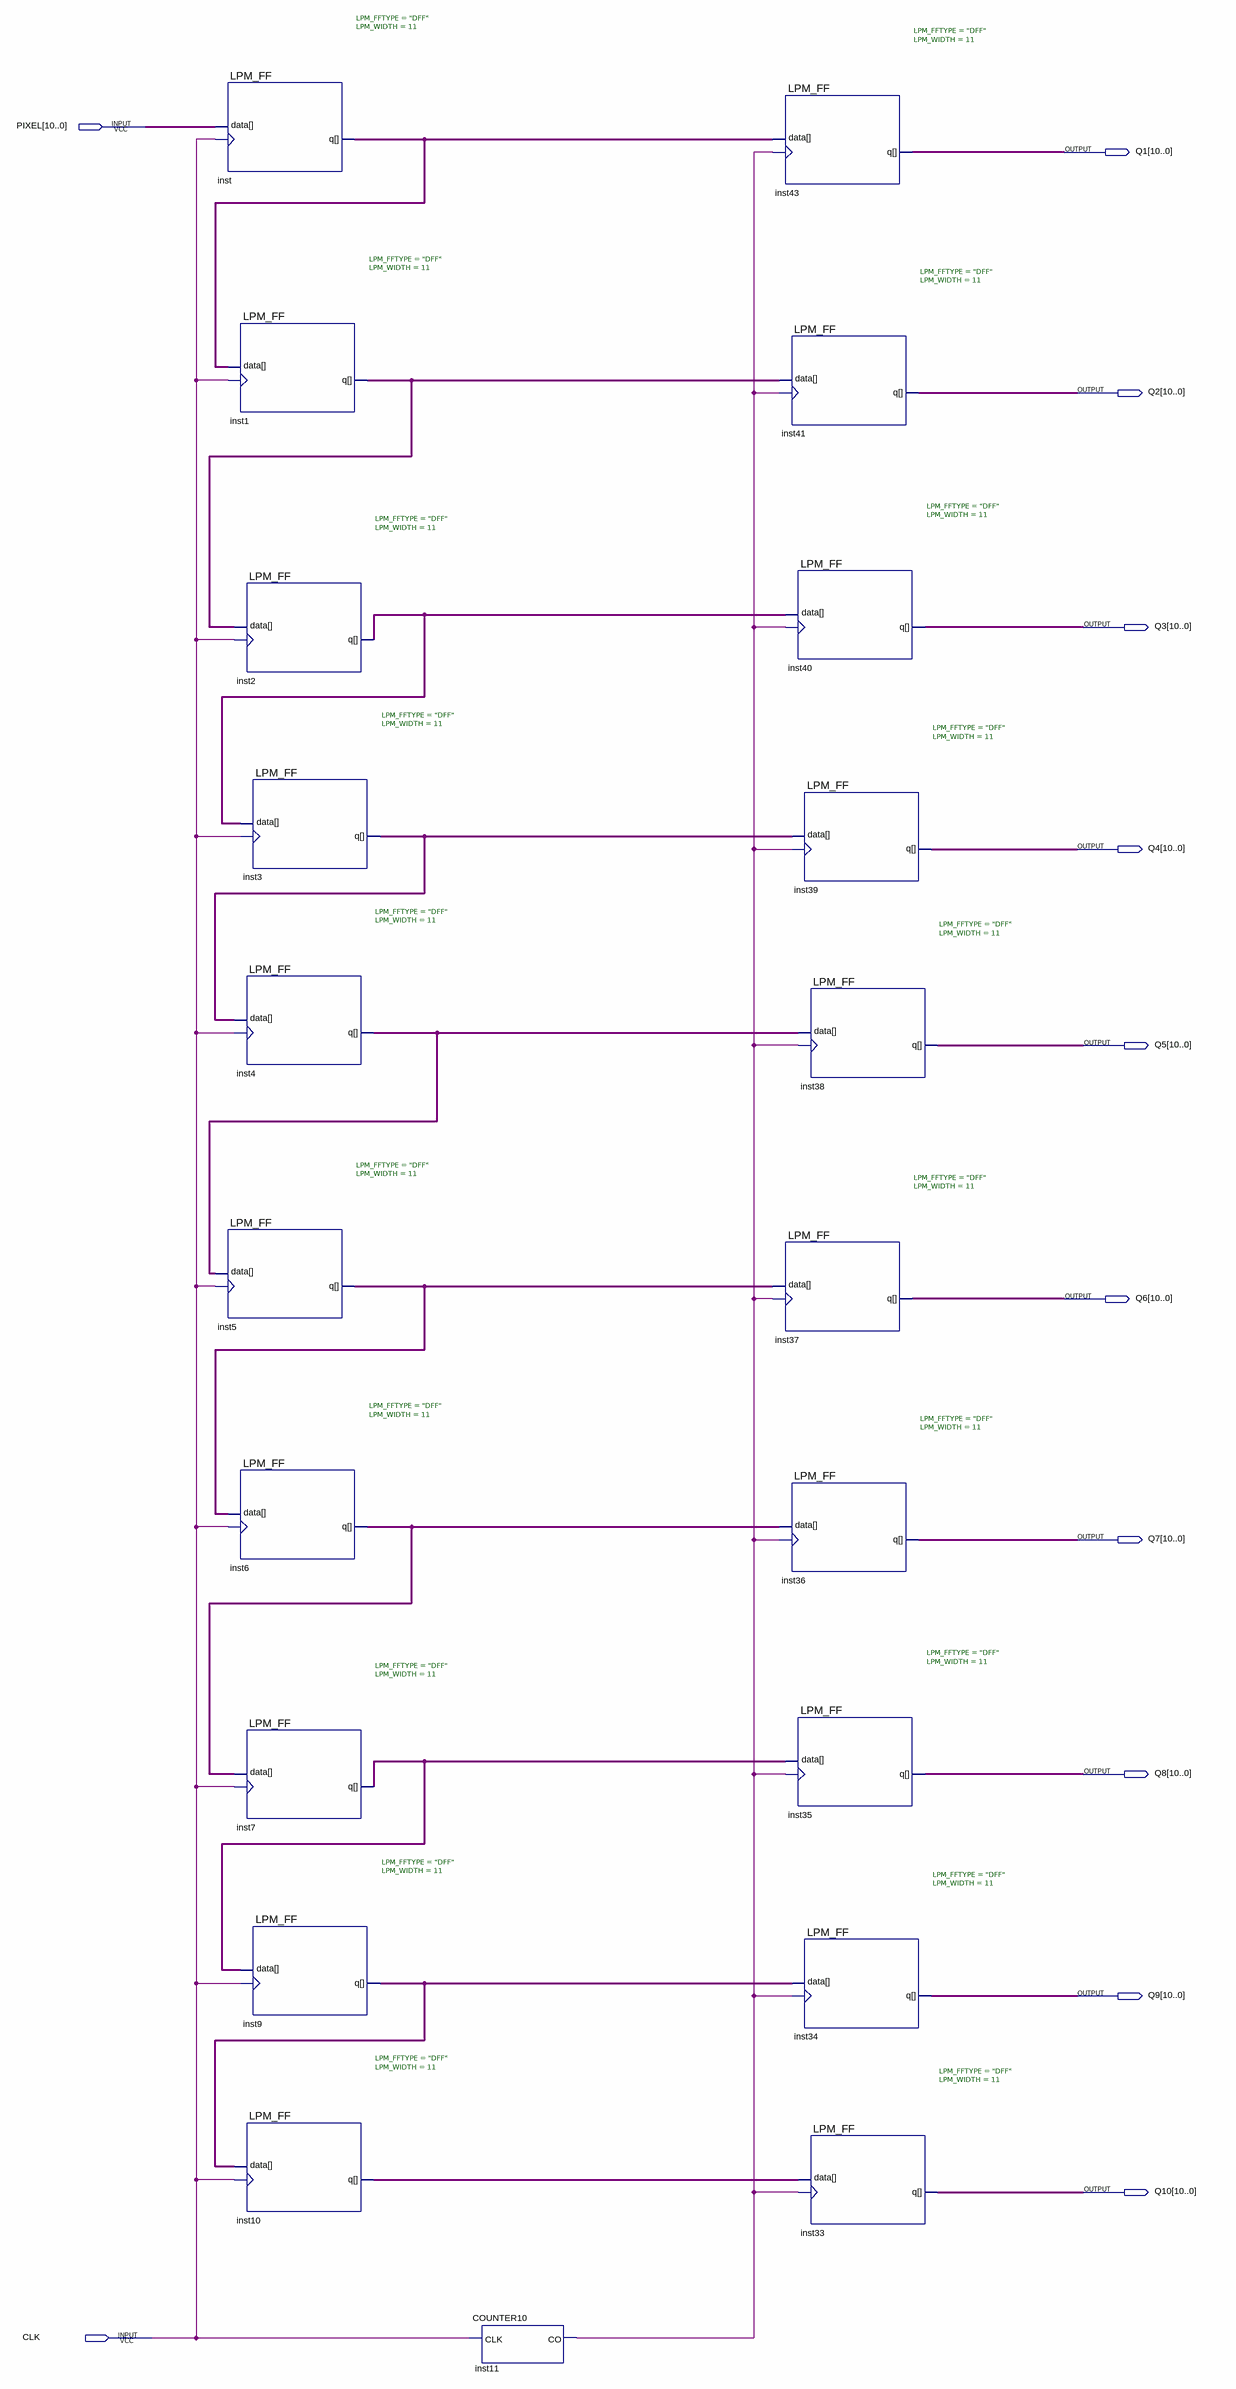
[diagram p0: schematic sheet]
// Quartus schematic SIPO10.bdf as structural Verilog: 21 symbols, 12 pins
module SIPO10 (
  input  [10:0] PIXEL,
  input  CLK,
  output [10:0] Q1,
  output [10:0] Q2,
  output [10:0] Q3,
  output [10:0] Q4,
  output [10:0] Q5,
  output [10:0] Q6,
  output [10:0] Q7,
  output [10:0] Q8,
  output [10:0] Q9,
  output [10:0] Q10
);

  wire inst11_co;
  wire [10:0] inst1_q, inst2_q, inst3_q, inst4_q, inst5_q, inst6_q, inst7_q, inst9_q, inst10_q, inst_q;

  LPM_FF #(.LPM_FFTYPE("DFF"), .LPM_WIDTH(11)) inst (.clock(CLK), .data(PIXEL), .q(inst_q));
  LPM_FF #(.LPM_FFTYPE("DFF"), .LPM_WIDTH(11)) inst1 (.clock(CLK), .data(inst_q), .q(inst1_q));
  LPM_FF #(.LPM_FFTYPE("DFF"), .LPM_WIDTH(11)) inst2 (.clock(CLK), .data(inst1_q), .q(inst2_q));
  LPM_FF #(.LPM_FFTYPE("DFF"), .LPM_WIDTH(11)) inst3 (.clock(CLK), .data(inst2_q), .q(inst3_q));
  LPM_FF #(.LPM_FFTYPE("DFF"), .LPM_WIDTH(11)) inst4 (.clock(CLK), .data(inst3_q), .q(inst4_q));
  LPM_FF #(.LPM_FFTYPE("DFF"), .LPM_WIDTH(11)) inst5 (.clock(CLK), .data(inst4_q), .q(inst5_q));
  LPM_FF #(.LPM_FFTYPE("DFF"), .LPM_WIDTH(11)) inst6 (.clock(CLK), .data(inst5_q), .q(inst6_q));
  LPM_FF #(.LPM_FFTYPE("DFF"), .LPM_WIDTH(11)) inst7 (.clock(CLK), .data(inst6_q), .q(inst7_q));
  LPM_FF #(.LPM_FFTYPE("DFF"), .LPM_WIDTH(11)) inst9 (.clock(CLK), .data(inst7_q), .q(inst9_q));
  LPM_FF #(.LPM_FFTYPE("DFF"), .LPM_WIDTH(11)) inst10 (.clock(CLK), .data(inst9_q), .q(inst10_q));
  COUNTER10 inst11 (.CLK(CLK), .CO(inst11_co));
  LPM_FF #(.LPM_FFTYPE("DFF"), .LPM_WIDTH(11)) inst43 (.clock(inst11_co), .data(inst_q), .q(Q1));
  LPM_FF #(.LPM_FFTYPE("DFF"), .LPM_WIDTH(11)) inst41 (.clock(inst11_co), .data(inst1_q), .q(Q2));
  LPM_FF #(.LPM_FFTYPE("DFF"), .LPM_WIDTH(11)) inst40 (.clock(inst11_co), .data(inst2_q), .q(Q3));
  LPM_FF #(.LPM_FFTYPE("DFF"), .LPM_WIDTH(11)) inst39 (.clock(inst11_co), .data(inst3_q), .q(Q4));
  LPM_FF #(.LPM_FFTYPE("DFF"), .LPM_WIDTH(11)) inst38 (.clock(inst11_co), .data(inst4_q), .q(Q5));
  LPM_FF #(.LPM_FFTYPE("DFF"), .LPM_WIDTH(11)) inst37 (.clock(inst11_co), .data(inst5_q), .q(Q6));
  LPM_FF #(.LPM_FFTYPE("DFF"), .LPM_WIDTH(11)) inst36 (.clock(inst11_co), .data(inst6_q), .q(Q7));
  LPM_FF #(.LPM_FFTYPE("DFF"), .LPM_WIDTH(11)) inst35 (.clock(inst11_co), .data(inst7_q), .q(Q8));
  LPM_FF #(.LPM_FFTYPE("DFF"), .LPM_WIDTH(11)) inst34 (.clock(inst11_co), .data(inst9_q), .q(Q9));
  LPM_FF #(.LPM_FFTYPE("DFF"), .LPM_WIDTH(11)) inst33 (.clock(inst11_co), .data(inst10_q), .q(Q10));
endmodule
